# EAGLE design nRF52833_MCU_simple (EAGLE 9.6.2)
Contributed by Nordic Semiconductor Product Page here <http://infocenter.nordicsemi.com/index.jsp?topic=%2Fcom.nordic.infocenter.nrf52832.ps.v1.1%2Fref_circuitry.html> Disclaimer: For the most up to date reference layout see the infocenter at nordicsemi.com Description: Bluetooth Low Energy board

## Sheet 1 of 2
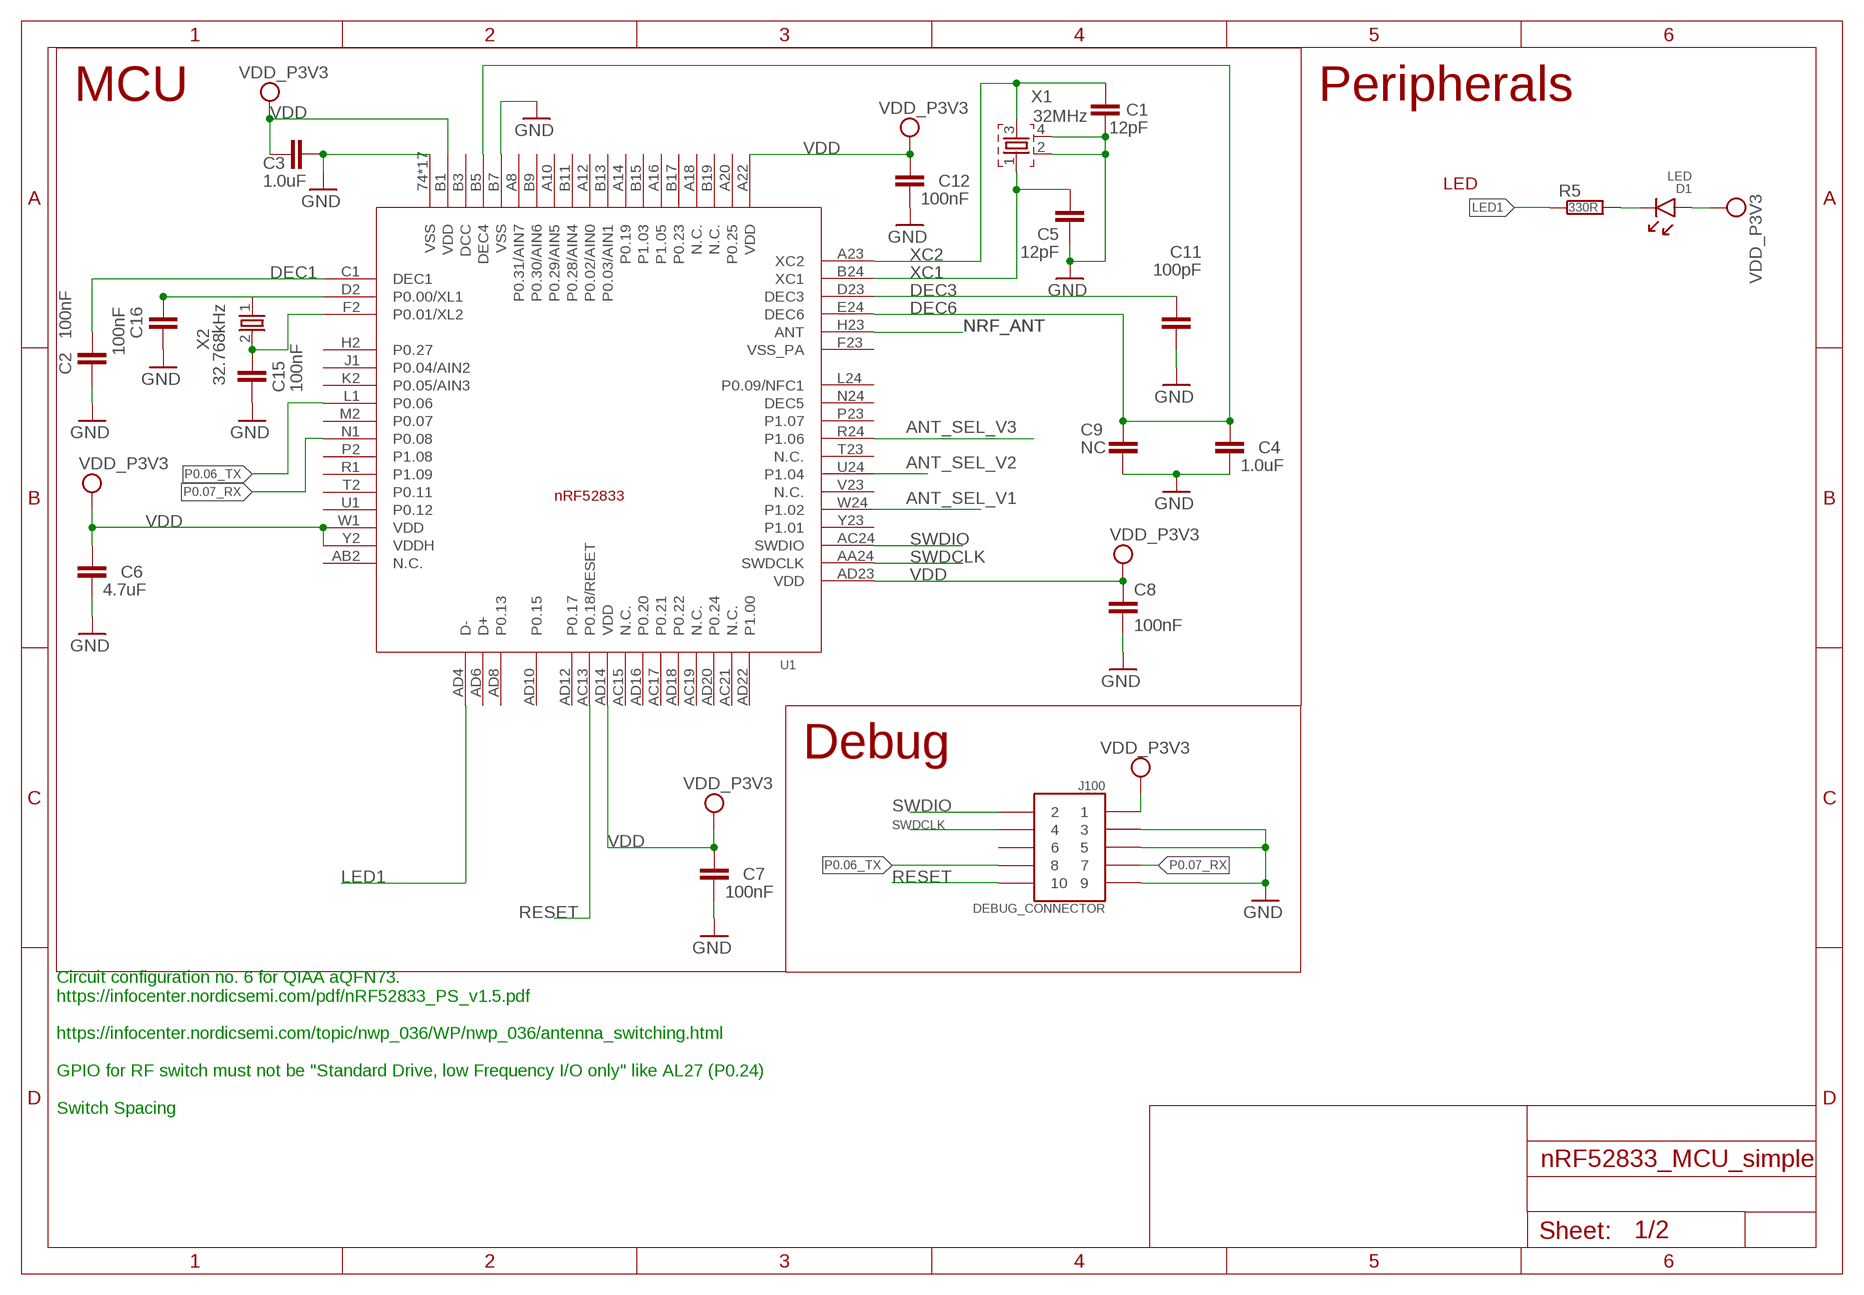
[diagram p0: schematic, sheet 1]

### Parts
C1  12pF  CAPACITOR_0402_N  [RESC0402_N]
C2  100nF  CAPACITOR_0402_N  [RESC0402_N]
C3  1.0uF  CAPACITOR_0402_N  [RESC0402_N]
C4  1.0uF  CAPACITOR_0402_N  [RESC0402_N]
C5  12pF  CAPACITOR_0402_N  [RESC0402_N]
C6  4.7uF  CAPACITOR_0402_N  [RESC0402_N]
C7  100nF  CAPACITOR_0402_N  [RESC0402_N]
C8  100nF  CAPACITOR_0402_N  [RESC0402_N]
C9  NC  CAPACITOR_0402_N  [RESC0402_N]
C11  100pF  CAPACITOR_0402_N  [RESC0402_N]
C12  100nF  CAPACITOR_0402_N  [RESC0402_N]
C15  100nF  CAPACITOR_0402_N  [RESC0402_N]
C16  100nF  CAPACITOR_0402_N  [RESC0402_N]
D1  LED  [DIOC0603_N]
J100  DEBUG_CONNECTOR  [HDRV127P5X2-10_N]
R5  330R  RESISTOR_0402_N  [RESC0402_N]
U1  nRF52833-QIAA  NRF52833_QIAANRF52833_QIAA_AQFN50P700X700X85_HS-74N  [AQFN50P700X700X85_HS-74N]
X1  32MHz  XTAL_32MHZ  [BT-XTAL_2016_N]
X2  32.768kHz  XTAL_32KHZ  [XTAL_3215_N]

### Nets
ANT_SEL_V1: U1.W24(P1.02)
ANT_SEL_V2: U1.U24(P1.04)
ANT_SEL_V3: U1.R24(P1.06)
DEC1: C2.1 U1.C1(DEC1)
DEC3: C11.1 U1.D23(DEC3)
DEC6: C4.1 C9.1 U1.B5(DEC4) U1.E24(DEC6)
GND: C1.2 C2.2 C3.2 C4.2 C5.2 C6.2 C7.2 C8.2 C9.2 C11.2 C12.2 C15.1 C16.1 J100.3 J100.5 J100.9 U1.74(VSS) U1.B7(VSS) U1.P$1(VSS) U1.P$2(VSS) U1.P$3(VSS) U1.P$4(VSS) U1.P$5(VSS) U1.P$10(VSS) U1.P$11(VSS) U1.P$12(VSS) U1.P$13(VSS) U1.P$14(VSS) U1.P$15(VSS) U1.P$16(VSS) U1.P$17(VSS) U1.P$18(VSS) U1.P$19(VSS) U1.P$20(VSS) X1.2 X1.4 ; also sheet 2
LED1: R5.1 U1.AD4(D-)
N$2: C16.2 U1.D2(P0.00/XL1) X2.1
N$3: C15.2 U1.F2(P0.01/XL2) X2.2
N$8: D1.1(C) R5.2
NRF_ANT: U1.H23(ANT) ; also sheet 2
P0.06_TX: J100.8 U1.L1(P0.06)
P0.07_RX: J100.7 U1.N1(P0.08)
RESET: J100.10 U1.AC13(P0.18/RESET)
SWDCLK: J100.4 U1.AA24(SWDCLK)
SWDIO: J100.2 U1.AC24(SWDIO)
VDD: C3.1 C6.1 C7.1 C8.1 C12.1 D1.2(A) J100.1 U1.A22(VDD) U1.AD14(VDD) U1.AD23(VDD) U1.B1(VDD) U1.W1(VDD) U1.Y2(VDDH) ; supply symbol labelled VDD_P3V3 ; also sheet 2
XC1: C5.1 U1.B24(XC1) X1.1
XC2: C1.1 U1.A23(XC2) X1.3
Unconnected: J100.6 U1.A8(P0.31/AIN7) U1.A10(P0.29/AIN5) U1.A12(P0.02/AIN0) U1.A14(P0.19) U1.A16(P1.05) U1.A18(N.C.) U1.A20(P0.25) U1.AB2(N.C.) U1.AC15(N.C.) U1.AC17(P0.21) U1.AC19(N.C.) U1.AC21(N.C.) U1.AD6(D+) U1.AD8(P0.13) U1.AD10(P0.15) U1.AD12(P0.17) U1.AD16(P0.20) U1.AD18(P0.22) U1.AD20(P0.24) U1.AD22(P1.00) U1.B3(DCC) U1.B9(P0.30/AIN6) U1.B11(P0.28/AIN4) U1.B13(P0.03/AIN1) U1.B15(P1.03) U1.B17(P0.23) U1.B19(N.C.) U1.H2(P0.27) U1.J1(P0.04/AIN2) U1.K2(P0.05/AIN3) U1.L24(P0.09/NFC1) U1.M2(P0.07) U1.P2(P1.08) U1.P23(P1.07) U1.R1(P1.09) U1.T2(P0.11) U1.T23(N.C.) U1.U1(P0.12) U1.V23(N.C.) U1.Y23(P1.01)

### Notes on the sheet
- MCU | Peripherals
- LED
- Debug
- Circuit configuration no. 6 for QIAA aQFN73.
  https://infocenter.nordicsemi.com/pdf/nRF52833_PS_v1.5.pdf
  
  https://infocenter.nordicsemi.com/topic/nwp_036/WP/nwp_036/antenna_switching.html
  
  GPIO for RF switch must not be "Standard Drive, low Frequency I/O only" like AL27 (P0.24)
  
  Switch Spacing

## Sheet 2 of 2
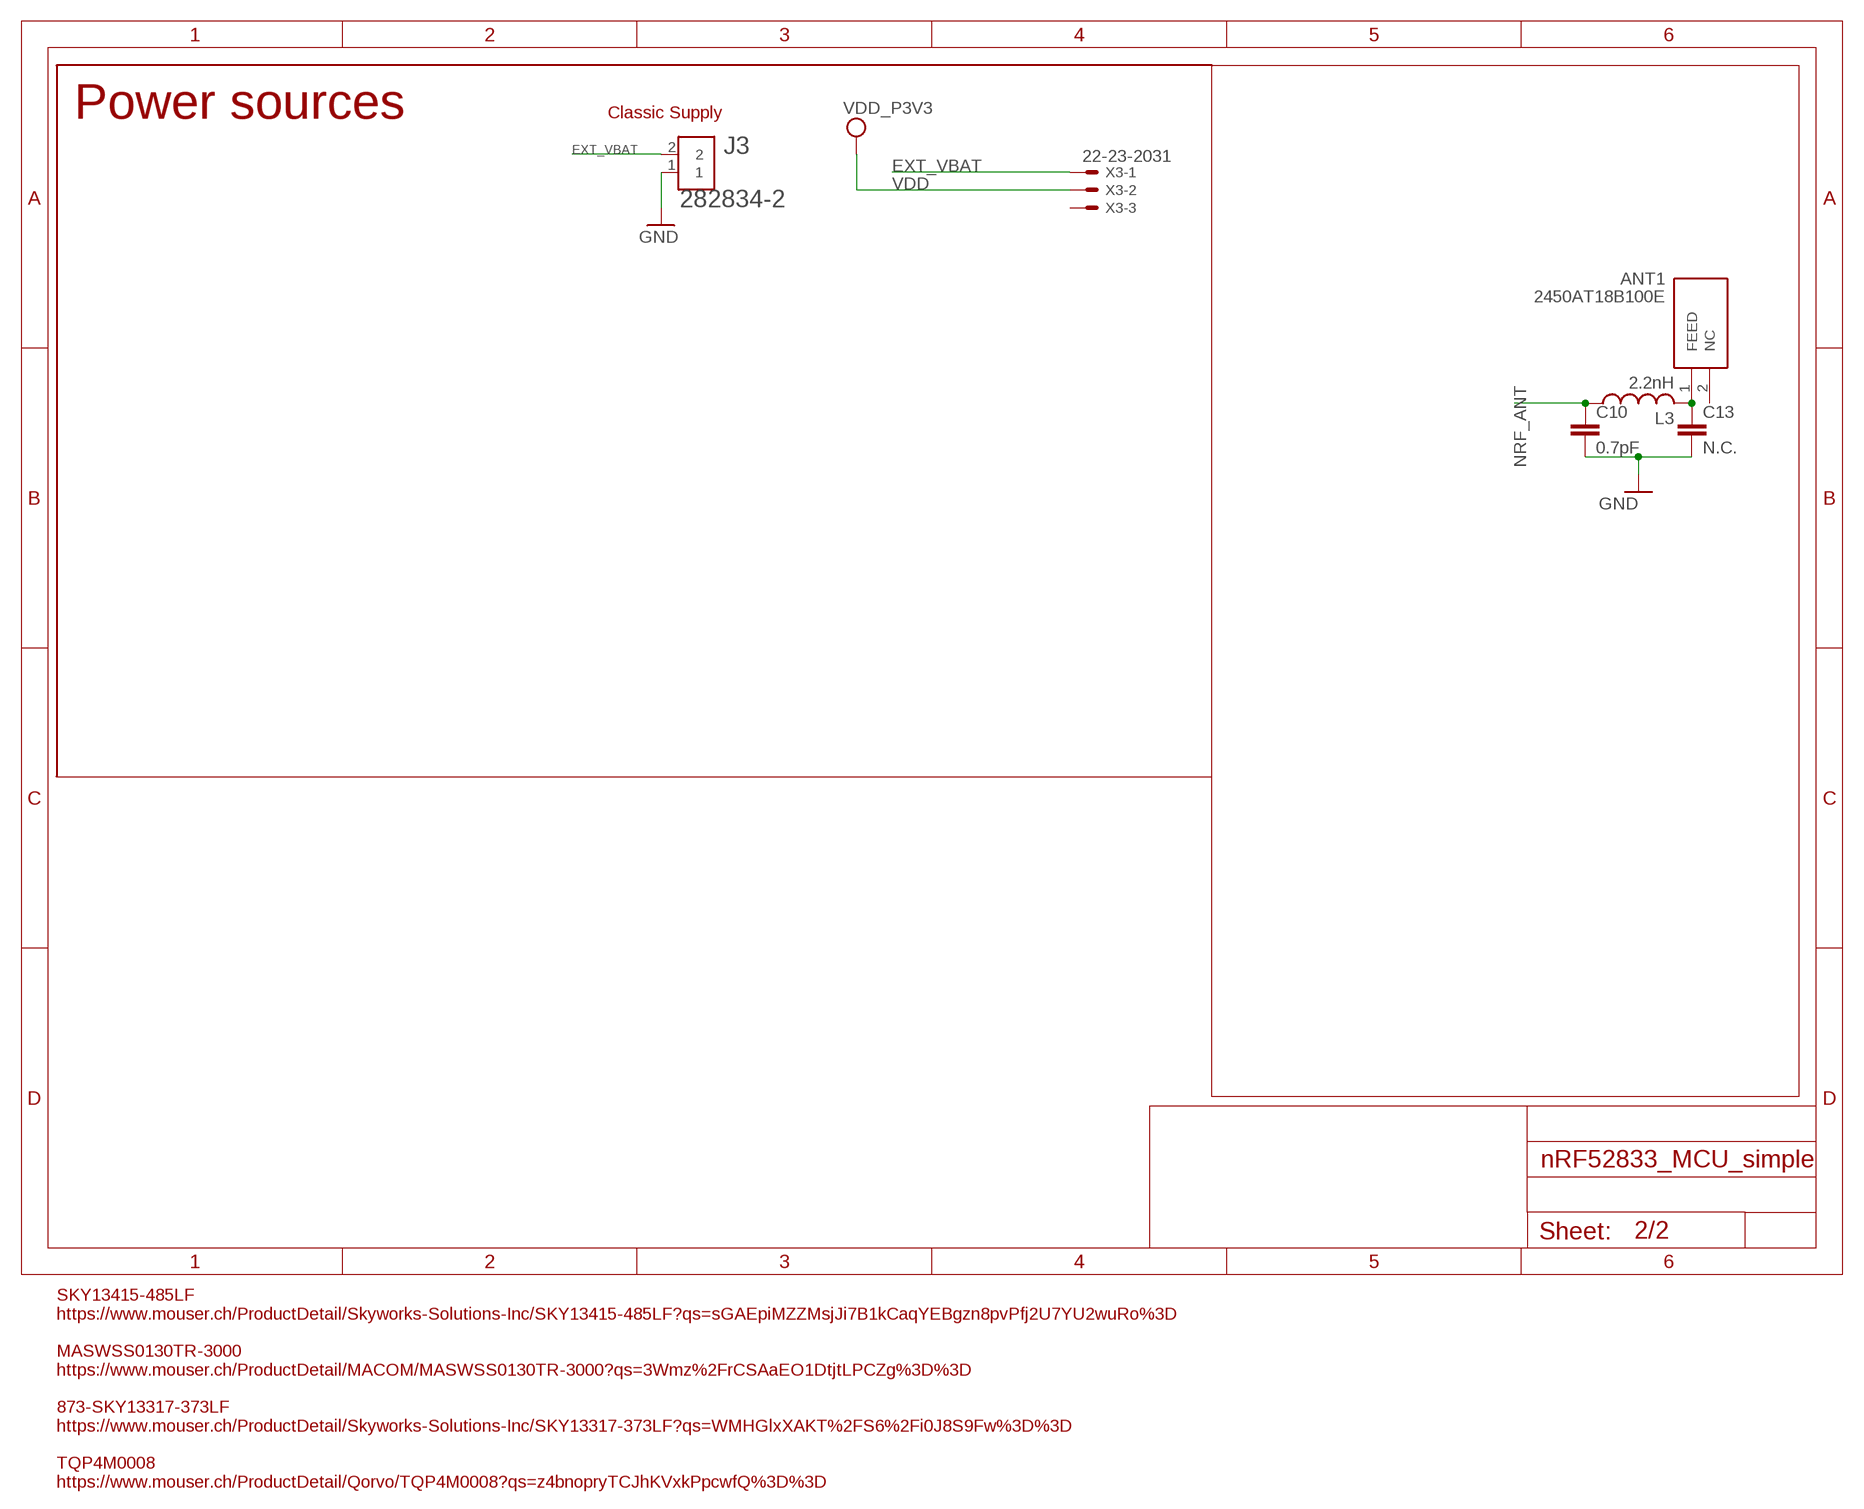
[diagram p1: schematic, sheet 2]

### Parts
ANT1  2450AT18B100E  [ANTC3216X140N]
C10  0.7pF  CAPACITOR_0402_N  [RESC0402_N]
C13  N.C.  CAPACITOR_0402_N  [RESC0402_N]
J3  282834-2  [CONN_282834-2]
L3  2.2nH  INDUCTOR_0402_N  [RESC0402_N]
X3  22-23-2031  [22-23-2031]

### Nets
EXT_VBAT: J3.2 X3.1
GND: C10.2 C13.2 J3.1 ; also sheet 1
N$5: ANT1.1(FEED) C13.1 L3.2
NRF_ANT: C10.1 L3.1 ; also sheet 1
VDD: X3.2 ; supply symbol labelled VDD_P3V3 ; also sheet 1
Unconnected: ANT1.2(NC) X3.3

### Notes on the sheet
- Power sources | Classic Supply
- SKY13415-485LF
  https://www.mouser.ch/ProductDetail/Skyworks-Solutions-Inc/SKY13415-485LF?qs=sGAEpiMZZMsjJi7B1kCaqYEBgzn8pvPfj2U7YU2wuRo%3D
  
  MASWSS0130TR-3000
  https://www.mouser.ch/ProductDetail/MACOM/MASWSS0130TR-3000?qs=3Wmz%2FrCSAaEO1DtjtLPCZg%3D%3D
  
  873-SKY13317-373LF
  https://www.mouser.ch/ProductDetail/Skyworks-Solutions-Inc/SKY13317-373LF?qs=WMHGlxXAKT%2FS6%2Fi0J8S9Fw%3D%3D
  
  TQP4M0008
  https://www.mouser.ch/ProductDetail/Qorvo/TQP4M0008?qs=z4bnopryTCJhKVxkPpcwfQ%3D%3D

## Power pins joined to a net without a drawn wire
DEC5: U1.N24(DEC5)
VSS_PA: U1.F23(VSS_PA)

## Library data of the parts
ANT1 = 2450AT18B100E:2450AT18B100E: Antennas 2.45GHz ANTENNA Source: Datasheet <https://www.johansontechnology.com/datasheets/2450AT18B100/2450AT18B100.pdf>; DESCRIPTION: Antennas 2.45GHz ANTENNA; HEIGHT: 1.4mm; MANUFACTURER_NAME: JOHANSON TECHNOLOGY; MANUFACTURER_PART_NUMBER: 2450AT18B100E; MOUSER_PART_NUMBER: 609-2450AT18B100E; MOUSER_PRICE-STOCK: https://www.mouser.co.uk/ProductDetail/Johanson-Technology/2450AT18B100E?qs=yCnrNFeXz%252Bh5MFsFIXGZGA%3D%3D
C1-C13 C15 C16 = Nordic_misc:CAPACITOR: Generic chip capacitor
D1 = Nordic_misc:LED
J3 = 282834-2:282834-2: Terminal block; 2.54mm; angled 90°; 0.03÷1mm2; ways: 2; 10A; H: 10mm; AVAILABILITY: Unavailable; CENTERLINE_PITCH: 2.54 mm[.1 in]; COMMENT: 282834-2; DESCRIPTION: TERMI-BLOK PCB MOUNT, 90 2P.; EU_ROHS_COMPLIANCE: Compliant with Exemptions; MF: TE Connectivity; MP: 282834-2; NUMBER_OF_POSITIONS: 2; PACKAGE: None; PRICE: None; TE_PURCHASE_URL: https://www.te.com/usa-en/product-282834-2.html?te_bu=Cor&te_type=disp&te_campaign=seda_glo_cor-seda-global-disp-prtnr-fy19-seda-model-bom-cta_sma-317_1&elqCampaignId=32493
J100 = Nordic_misc:DEBUG_CONNECTOR
L3 = Nordic_misc:INDUCTOR: Generic chip inductor
R5 = Nordic_misc:RESISTOR: Generic chip resistor
U1 = nrf52833_qiaa:NRF52833_QIAA: Multi-protocol Bluetooth Low Energy, IEEE 802.15.4, ANT and 2.4GHz proprietary system-on-chip; FOOTPRINT_DOC: AQFN-73; LATESTREVISIONDATE: 2018-12-03; MANUFACTURER: Nordic Semiconductor; MANUFACTURER_PART_NUMBER: nRF52833-QIAA; NOTE: *; PART_NUMBER: nRF52833-QIAA; PIN_COUNT: 73; PUBLISHED: 2018-12-03; PUBLISHER: Nordic Semiconductor
X1 = Nordic_nRF:XTAL_32MHZ
X2 = Nordic_nRF:XTAL_32KHZ
X3 = con-molex:22-23-2031: .100" (2.54mm) Center Header - 3 Pin; MF: MOLEX; MPN: 22-23-2031; OC_FARNELL: 1462950; OC_NEWARK: 30C0862

## Net classes
0 default: clearance 0.205 mm

## Board
Contributed by Nordic Semiconductor Product Page here <http://infocenter.nordicsemi.com/index.jsp?topic=%2Fcom.nordic.infocenter.nrf52832.ps.v1.1%2Fref_circuitry.html> Disclaimer: For the most up to date reference layout see the infocenter at nordicsemi.com Description: Bluetooth Low Energy board
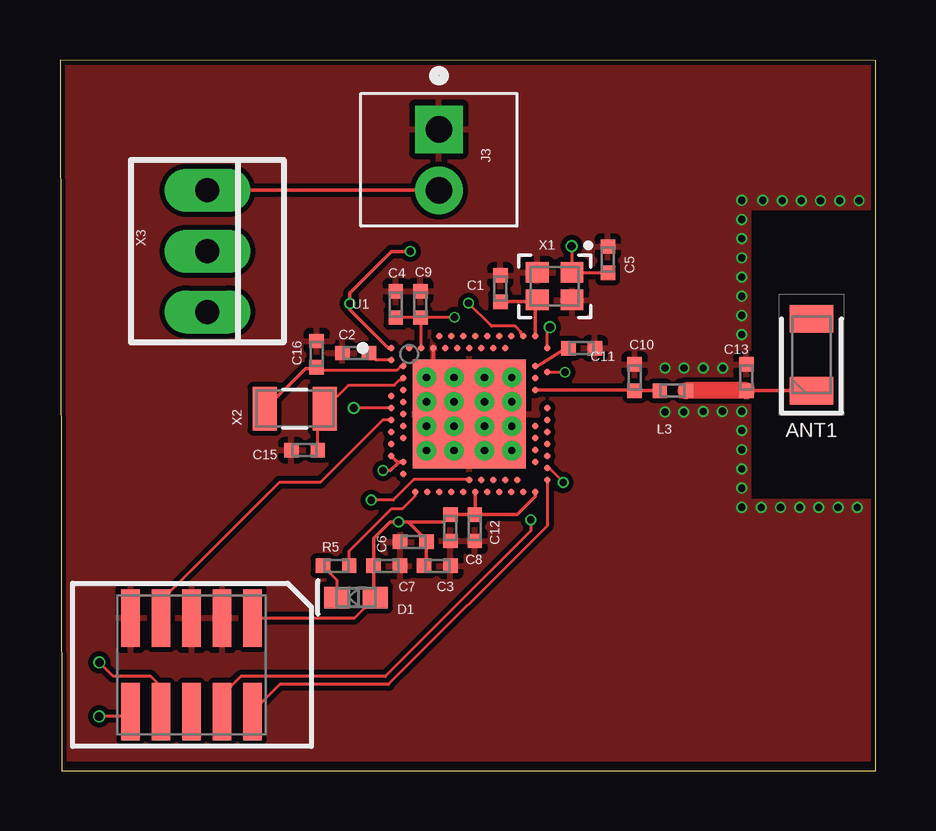
[diagram p2: board, top side]
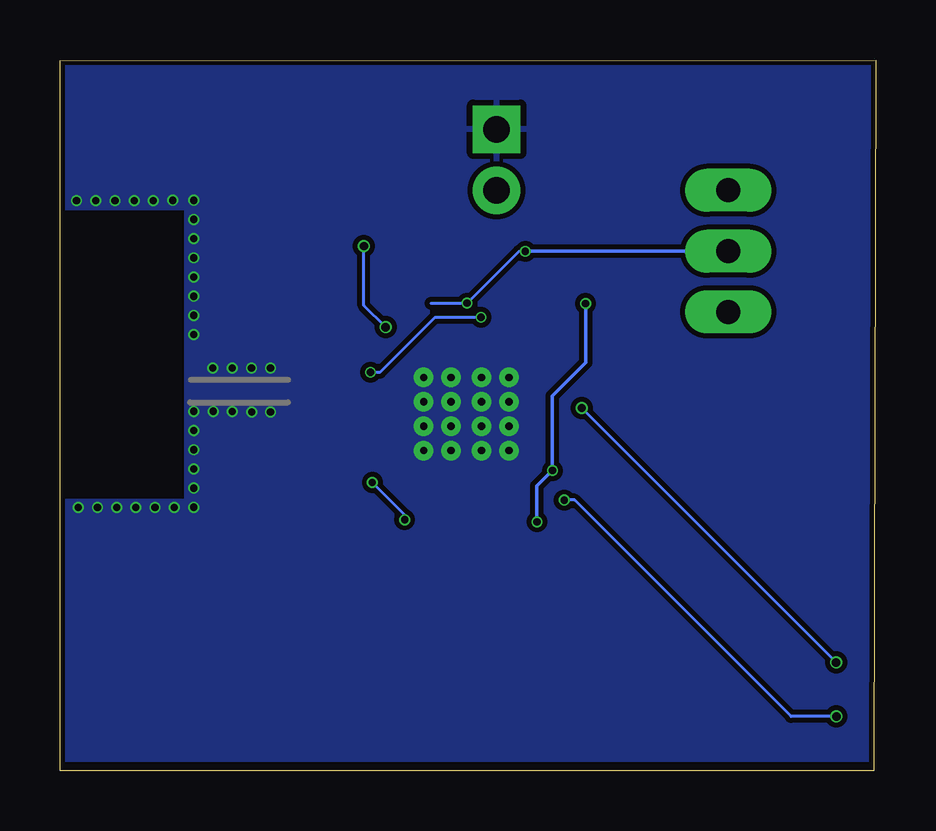
[diagram p3: board, bottom side, seen from below]

Size 33.98 x 29.64 mm. Coordinates in mm from the lower left corner, seen from the top.
Outline: 0.08,0 33.98,0 33.98,29.6 0,29.64 0.08,0
Copper layers (1*16): Top 0.035mm / dielectric 1.6mm / Bottom 0.035mm
Design rules "jlcpcb-2layers": minimum track width 5mil, minimum drill 0.3mm, track to track 5mil, track to pad 5mil, pad to pad 5mil, via to via 5mil, smd to smd 5mil, copper to edge 0.2mm, drill to drill 6mil, minimum pad ring 10mil, minimum via ring 3mil, stop-mask expansion 4mil, vias tented up to drill 0mil, thermal gap 10mil
tRestrict: area 28.8,11.4 to 33.8,23.4
bRestrict: area 28.8,11.4 to 33.8,23.4

### Footprints (pad centres in the part's own frame; a part is rotated, then mirrored left to right if it is on the bottom)
ANTC3216X140N = smd 1.15 x 1.8: 1 -1.5,0; 2 1.5,0
RESC0402_N = smd 0.6 x 0.6: 1 -0.55,0; 2 0.55,0
DIOC0603_N = smd 1.05 x 0.9: 1 -0.8,0; 2 0.8,0
CONN_282834-2 = drill 1.1 square: 1 -1.27,0 | drill 1.1: 2 1.27,0
HDRV127P5X2-10_N = smd 0.76 x 2.4: 1 -2.54,-1.95; 2 -2.54,1.95; 3 -1.27,-1.95; 4 -1.27,1.95; 5 0,-1.95; 6 0,1.95; 7 1.27,-1.95; 8 1.27,1.95; 9 2.54,-1.95; 10 2.54,1.95
AQFN50P700X700X85_HS-74N = smd 4.699 x 4.547: 74 0,0 | smd 0.275 x 0.275: A8 -1.25,3.25; A10 -0.75,3.25; A12 -0.25,3.25; A14 0.25,3.25; A16 0.75,3.25; A18 1.25,3.25; A20 1.75,3.25; A22 2.25,3.25; A23 2.75,3.25; AA24 3.25,-2.25; AB2 -2.75,-2.5; AC13 0,-2.75; AC15 0.5,-2.75; AC17 1,-2.75; AC19 1.5,-2.75; AC21 2,-2.75; AC24 3.25,-2.75; AD4 -2.25,-3.25; AD6 -1.75,-3.25; AD8 -1.25,-3.25; AD10 -0.75,-3.25; AD12 -0.25,-3.25; AD14 0.25,-3.25; AD16 0.75,-3.25; AD18 1.25,-3.25; AD20 1.75,-3.25; AD22 2.25,-3.25; AD23 2.75,-3.25; B1 -3.25,2.75; B3 -2.5,2.75; B5 -2,2.75; B7 -1.5,2.75; B9 -1,2.75; B11 -0.5,2.75; B13 0,2.75; B15 0.5,2.75; B17 1,2.75; B19 1.5,2.75; B24 3.25,2.75; C1 -3.25,2.25; D2 -2.75,2; D23 2.75,2; E24 3.25,1.75; F2 -2.75,1.5; F23 2.75,1.5; H2 -2.75,1; H23 2.75,1; J1 -3.25,0.75; K2 -2.75,0.5; L1 -3.25,0.25; L24 3.25,0.25; M2 -2.75,0; N1 -3.25,-0.25; N24 3.25,-0.25; P2 -2.75,-0.5; P23 2.75,-0.5; R1 -3.25,-0.75; R24 3.25,-0.75; T2 -2.75,-1; T23 2.75,-1; U1 -3.25,-1.25; U24 3.25,-1.25; V23 2.75,-1.5; W1 -3.25,-1.75; W24 3.25,-1.75; Y2 -2.75,-2; Y23 2.75,-2 | drill 0.3 pad 0.406: P$1 -1.778,1.524; P$2 -0.635,-0.508; P$3 -0.635,1.524; P$4 0.635,1.524; P$5 -1.778,-0.508; P$10 -1.778,-1.524; P$11 -0.635,-1.524; P$12 0.635,-1.524; P$13 1.778,-1.524; P$14 0.635,-0.508; P$15 1.778,-0.508; P$16 1.778,1.524; P$17 -1.778,0.508; P$18 -0.635,0.508; P$19 0.635,0.508; P$20 1.778,0.508
BT-XTAL_2016_N = smd 0.95 x 0.85: 1 -0.725,-0.575; 2 0.725,-0.575; 3 0.725,0.575; 4 -0.725,0.575
XTAL_3215_N = smd 1 x 1.8: 1 -1.25,0; 2 1.25,0
22-23-2031 = drill 1 long: 1 -2.54,0; 2 0,0; 3 2.54,0

### Placement (x,y rotation side)
ANT1  31.31,17.35 90 top
C1  18.35,20.11 90 top
C2  12.32,17.42 180 top
C3  15.72,8.55 0 top
C4  13.99,19.45 90 top
C5  22.83,21.31 90 top
C6  14.72,9.55 180 top
C7  13.62,8.55 0 top
C8  16.27,10.14 270 top
C9  15.02,19.45 90 top
C10  23.94,16.4 90 top
C11  21.74,17.62 0 top
C12  17.28,10.14 270 top
C13  28.6,16.4 90 top
C15  10.19,13.37 0 top
C16  10.69,17.37 270 top
D1  12.34,7.23 0 top
J3  15.79,25.48 270 top
J100  5.48,4.42 180 top
L3  25.54,15.85 0 top
R5  11.5,8.55 180 top
U1  17.05,14.88 0 top
X1  20.61,20.21 180 top
X2  9.78,15.1 0 top
X3  6.14,21.67 270 top

### Tracks (layer width: path | path; a pad name or v marks a point on that pad's centre or on a via)
DEC1
  Top 0.127: U1.C1 13.15,17.13 C2.1
DEC3
  Top 0.127: U1.D23 19.91,16.88 21.13,17.65 C11.1
DEC6  (via drill 0.3)
  Top 0.127: U1.B5 15.05,18.87 C9.1 | C9.1 C4.1 | v16.44,18.91 C9.1 | U1.E24 v21.03,16.63 v21.04,16.62
  Top 0.152: U1.B5 | v16.44,18.91
  Bottom 0.127: v21.04,16.62 20.64,16.62 18.35,18.91 v16.44,18.91
EXT_VBAT
  Top 0.152: 15.83,24.21 J3.2 X3.1
GND  (via drill 0.3)
  Top 0.152: U1.B7 15.55,16.68 U1.P$1 | U1.74 17.18,14.88 U1.P$14
  other vias: 27.61,16.8 26.8,16.8 27.6,14.99 26.8,14.98 28.41,10.99 28.41,11.79 28.41,12.59 28.41,13.39 28.41,14.19 28.41,14.99 28.41,18.19 28.41,18.99 28.41,19.79 28.41,20.59 28.41,21.39 28.41,22.19 28.41,22.99 28.41,23.79 29.22,10.98 30.02,10.98 30.82,10.98 31.62,10.98 32.42,10.98 33.22,10.98 25.99,14.96 26,16.8 25.21,14.96 25.21,16.79 29.28,23.79 30.09,23.78 30.89,23.78 31.69,23.78 32.49,23.78 33.29,23.78
  pour Bottom: 0.11,0.48 0.11,29.56 33.91,29.56 33.91,0.48
  pour Top: 0.11,0.48 0.11,29.56 33.92,29.56 33.92,0.48
LED1
  Top 0.127: R5.1 12.05,9.16 13.83,10.94 14.28,10.94 14.8,11.46 U1.AD4
N$2
  Top 0.127: U1.D2 14.28,16.86 14.19,16.86 14.03,16.69 10.75,16.69 10.66,16.78
  Top 0.152: X2.1 8.55,15.1 10.23,16.78 10.65,16.78 | 10.66,16.78 10.65,16.78 | C16.2 10.65,16.78
N$3
  Top 0.127: C15.2 10.74,14.81 X2.2 12.03,16.09 13.93,16.09 14.13,16.29 14.21,16.29 U1.F2
N$5
  Top 0.152: ANT1.1 C13.1
  Top 0.7: C13.1 L3.2 | L3.2
N$8
  Top 0.127: R5.2 11.54,7.96 D1.1
NRF_ANT
  Top 0.152: L3.1 C10.1 23.91,15.88 U1.H23
P0.06_TX  (via drill 0.35)
  Top 0.127: U1.L1 v12.24,15.13 | v1.64,4.52 2.21,3.95 3.78,3.95 4.27,3.46 4.27,2.53 J100.8
  Bottom 0.127: v12.24,15.13 v1.64,4.53 v1.64,4.52
P0.07_RX
  Top 0.127: U1.N1 13.45,14.63 10.85,12.03 9.14,12.03 4.21,7.1 J100.7
RESET  (via drill 0.3, 0.35)
  Top 0.127: J100.10 2.74,2.27 v1.63,2.27 | v12.97,11.29 13.89,11.29 14.74,12.15 17.03,12.15 U1.AC13
  Bottom 0.127: v12.97,11.29 12.54,11.29 3.52,2.27 v1.63,2.27
SWDCLK  (via drill 0.3)
  Top 0.127: U1.AA24 20.38,12.63 20.96,12.04 v20.96,12.02 | v19.62,10.47 19.62,10.01 13.55,3.94 7.53,3.94 6.75,3.16 J100.4
  Bottom 0.127: v20.96,12.02 19.62,10.68 v19.62,10.47
SWDIO
  Top 0.127: U1.AC24 20.3,10.21 13.68,3.6 9.15,3.6 J100.2
VDD  (via drill 0.3)
  Top 0.127: U1.A22 19.21,18.22 19.21,18.3 18.97,18.54 17.98,18.54 v17.02,19.5 | J100.1 12.28,6.37 13.11,7.2 13.11,7.26 D1.2 13.07,7.3
  Top 0.152: v14.11,10.39 13.76,10.39 13.07,9.69 C7.1 13.07,7.3 | U1.AD14 17.3,10.71 C12.1 | U1.B1 13.68,17.63 12.08,19.23 v12.08,19.48 12.08,19.93 13.81,21.66 v14.59,21.66 | C3.1 15.27,8.65 C6.1 15.27,9.63 14.52,10.39 v14.11,10.39 | v13.46,12.52 13.77,12.52 14.13,12.88 U1.Y2 14.05,12.88 U1.W1 | v14.11,10.39 v14.11,10.38 15.96,10.38 C8.1 C12.1 | C12.1 19.05,10.69 19.8,11.44 U1.AD23
  Bottom 0.127: v14.59,21.66 14.86,21.66 v17.02,19.5 18.51,19.5
  Bottom 0.152: X3.2 v14.59,21.67 v14.59,21.66 | v12.08,19.48 12.08,17.02 13.46,15.64 v13.46,12.52 14.11,11.87 v14.11,10.39
XC1  (via drill 0.35)
  Top 0.127: C5.1 22.81,20.78 X1.1 21.32,20.8 v21.32,21.88 | U1.B24 20.3,18.39 v20.41,18.5
  Bottom 0.127: v20.41,18.5 21.32,19.41 v21.32,21.88
XC2
  Top 0.152: U1.A23 19.8,19.55 19.81,19.56 | X1.3 19.81,19.56 | 19.81,19.56 C1.1

### Text on the board
tNames: v0.1.1 / Beacon